# EAGLE schematic alu (EAGLE 9.6.2)
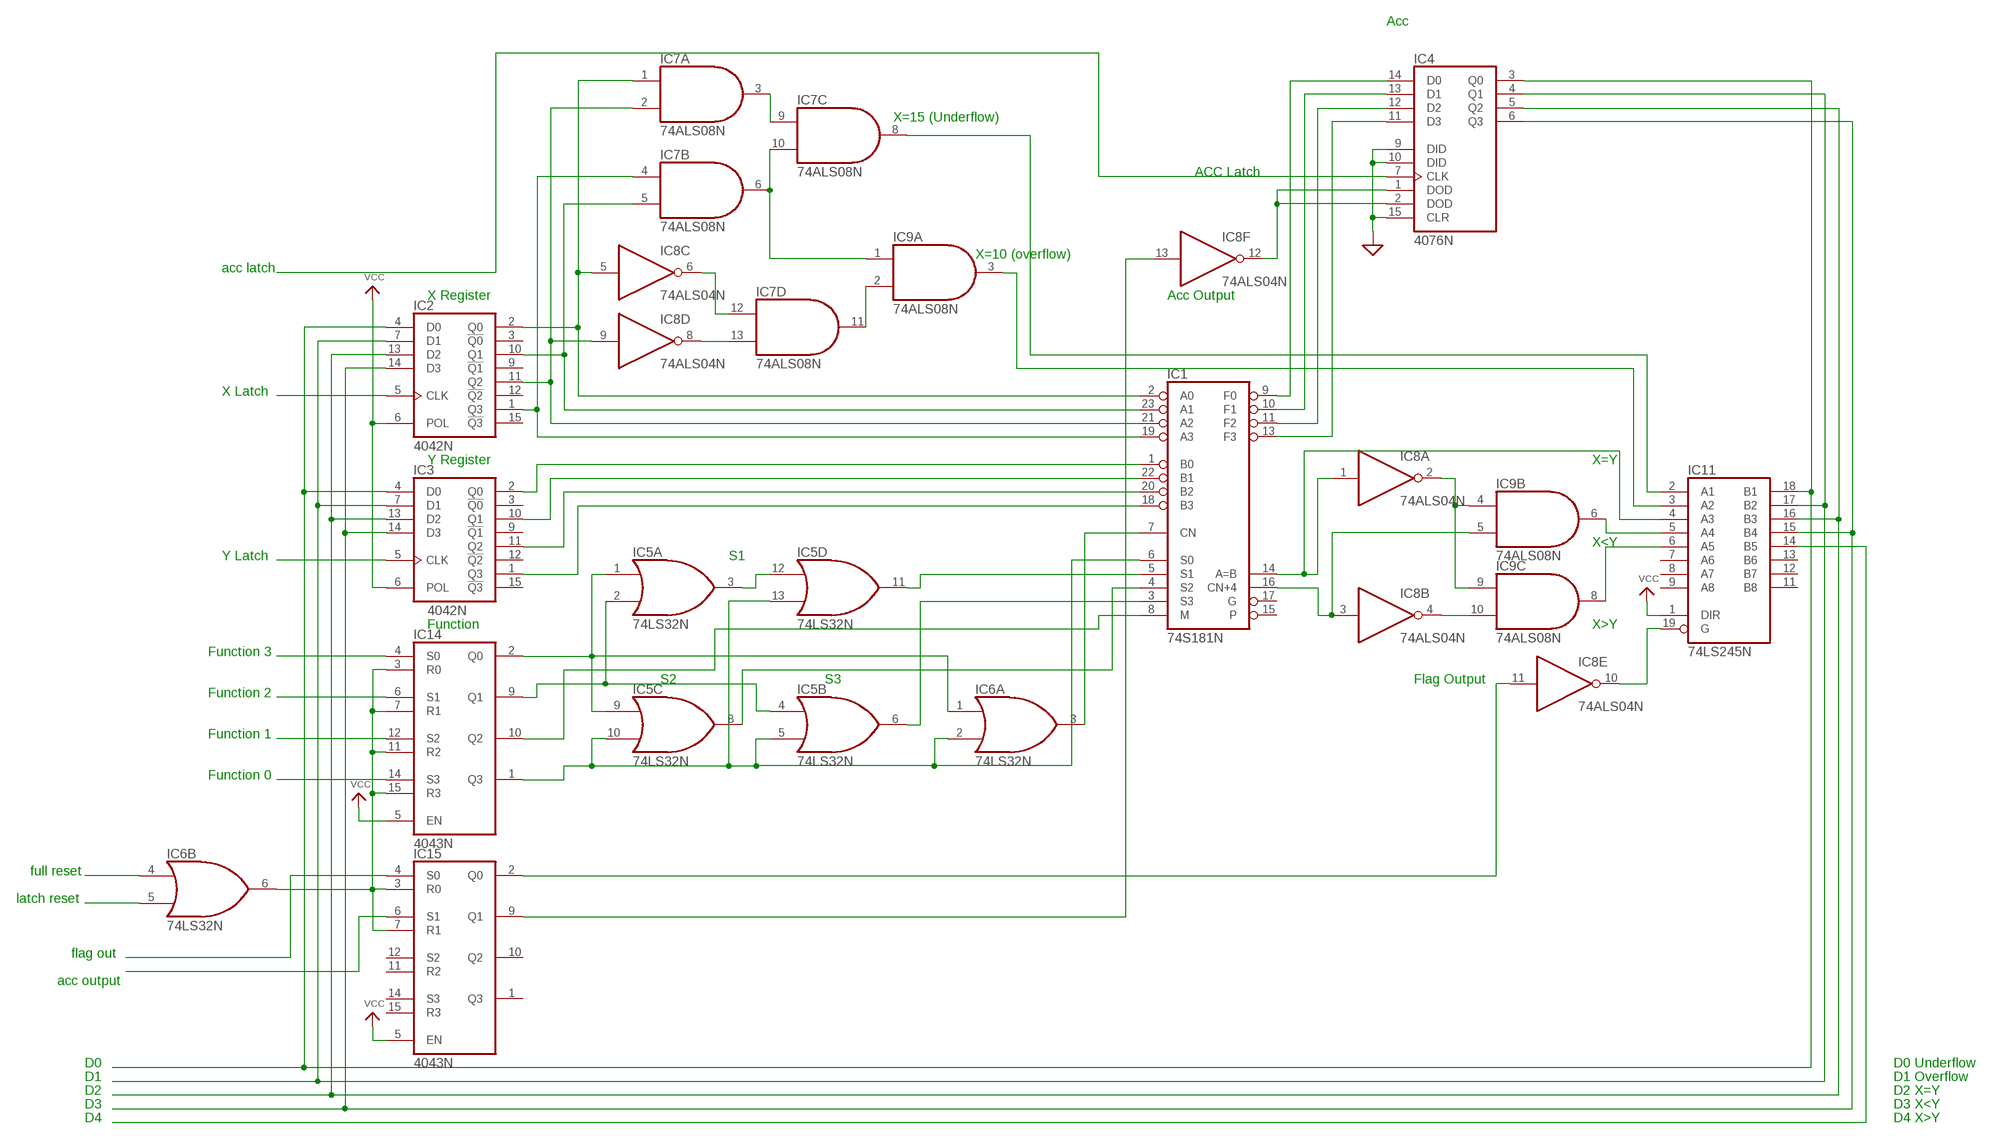
[diagram p0: schematic, sheet 1]

## Parts
IC1  74S181N  [DIL24-6]
IC2  4042N  [DIL16]
IC3  4042N  [DIL16]
IC4  4076N  [DIL16]
IC5  74LS32N  [DIL14]
IC6  74LS32N  [DIL14]
IC7  74ALS08N  [DIL14]
IC8  74ALS04N  [DIL14]
IC9  74ALS08N  [DIL14]
IC11  74LS245N  [DIL20]
IC14  4043N  [DIL16]
IC15  4043N  [DIL16]

## Nets
GND: IC4.9(DID) IC4.10(DID) IC4.15(CLR) ; supply symbol labelled SUP
N$1: IC1.2(A0) IC2.2(Q0) IC7.1(A:I0) IC8.5(C:I)
N$2: IC1.23(A1) IC2.10(Q1) IC7.5(B:I1)
N$3: IC7.13(D:I1) IC8.8(D:O)
N$4: IC1.19(A3) IC2.1(Q3) IC7.4(B:I0)
N$5: IC1.1(B0) IC3.2(Q0)
N$6: IC1.22(B1) IC3.10(Q1)
N$7: IC1.20(B2) IC3.11(Q2)
N$8: IC1.18(B3) IC3.1(Q3)
N$9: IC2.4(D0) IC3.4(D0) IC4.3(Q0) IC11.18(B1)
N$10: IC2.7(D1) IC3.7(D1) IC4.4(Q1) IC11.17(B2)
N$11: IC2.13(D2) IC3.13(D2) IC4.5(Q2) IC11.16(B3)
N$12: IC2.14(D3) IC3.14(D3) IC4.6(Q3) IC11.15(B4)
N$13: IC11.14(B5)
N$14: IC6.6(B:O) IC14.3(R0) IC14.7(R1) IC14.11(R2) IC14.15(R3) IC15.3(R0) IC15.7(R1)
N$15: IC4.1(DOD) IC4.2(DOD) IC8.12(F:O)
N$16: IC6.4(B:I0)
N$17: IC15.4(S0)
N$18: IC15.6(S1)
N$19: IC14.4(S0)
N$20: IC14.6(S1)
N$21: IC14.12(S2)
N$22: IC14.14(S3)
N$23: IC6.5(B:I1)
N$25: IC5.3(A:O) IC5.12(D:I0)
N$26: IC1.5(S1) IC5.11(D:O)
N$27: IC1.3(S3) IC5.6(B:O)
N$28: IC1.6(S0) IC5.5(B:I1) IC5.10(C:I1) IC5.13(D:I1) IC6.2(A:I1) IC14.1(Q3)
N$29: IC5.1(A:I0) IC5.9(C:I0) IC6.1(A:I0) IC14.2(Q0)
N$30: IC1.16(CN+4) IC8.3(B:I) IC9.5(B:I1)
N$31: IC1.4(S2) IC5.8(C:O)
N$32: IC1.8(M) IC14.10(Q2)
N$33: IC1.7(CN) IC6.3(A:O)
N$34: IC1.9(F0) IC4.14(D0)
N$35: IC5.2(A:I1) IC5.4(B:I0) IC14.9(Q1)
N$36: IC1.10(F1) IC4.13(D1)
N$37: IC1.11(F2) IC4.12(D2)
N$38: IC1.13(F3) IC4.11(D3)
N$39: IC4.7(CLK)
N$40: IC8.4(B:O) IC9.10(C:I1)
N$41: IC1.14(A=B) IC8.1(A:I) IC11.4(A3)
N$42: IC7.12(D:I0) IC8.6(C:O)
N$43: IC8.2(A:O) IC9.4(B:I0) IC9.9(C:I0)
N$44: IC7.3(A:O) IC7.9(C:I0)
N$45: IC7.6(B:O) IC7.10(C:I1) IC9.1(A:I0)
N$46: IC7.11(D:O) IC9.2(A:I1)
N$47: IC1.21(A2) IC2.11(Q2) IC7.2(A:I1) IC8.9(D:I)
N$49: IC9.3(A:O) IC11.3(A2)
N$50: IC7.8(C:O) IC11.2(A1)
N$55: IC9.6(B:O) IC11.5(A4)
N$56: IC9.8(C:O) IC11.6(A5)
N$61: IC8.10(E:O) IC11.19(G)
N$63: IC8.11(E:I) IC15.2(Q0)
N$64: IC8.13(F:I) IC15.9(Q1)
VCC: IC2.6(POL) IC3.6(POL) IC11.1(DIR) IC14.5(EN) IC15.5(EN)
XCLOCK: IC2.5(CLK)
YCLOCK: IC3.5(CLK)
Unconnected: IC1.15(P) IC1.17(G) IC2.3(!Q0) IC2.9(!Q1) IC2.12(!Q2) IC2.15(!Q3) IC3.3(!Q0) IC3.9(!Q1) IC3.12(!Q2) IC3.15(!Q3) IC6.8(C:O) IC6.9(C:I0) IC6.10(C:I1) IC6.11(D:O) IC6.12(D:I0) IC6.13(D:I1) IC9.11(D:O) IC9.12(D:I0) IC9.13(D:I1) IC11.7(A6) IC11.8(A7) IC11.9(A8) IC11.11(B8) IC11.12(B7) IC11.13(B6) IC15.1(Q3) IC15.10(Q2) IC15.11(R2) IC15.12(S2) IC15.14(S3) IC15.15(R3)

## Notes on the sheet
- Acc
- X=15 (Underflow)
- ACC Latch
- X=10 (overflow)
- acc latch
- X Register | Acc Output
- X Latch
- Y Register | X=Y
- X<Y
- Y Latch | S1
- Function | X>Y
- Function 3
- S2 | S3 | Flag Output
- Function 2
- Function 1
- Function 0
- full reset
- latch reset
- flag out
- acc output
- D0 | D0 Underflow
- D1 | D1 Overflow
- D2 | D2 X=Y
- D3 | D3 X<Y
- D4 | D4 X>Y

## Power pins joined to a net without a drawn wire
GND: IC1.12(GND) IC5.7(P:GND) IC6.7(P:GND) IC7.7(P:GND) IC8.7(P:GND) IC9.7(P:GND) IC11.10(GND)
VCC: IC1.24(VCC) IC5.14(P:VCC) IC6.14(P:VCC) IC7.14(P:VCC) IC8.14(P:VCC) IC9.14(P:VCC) IC11.20(VCC)
VDD: IC2.16(VDD) IC3.16(VDD) IC4.16(VDD) IC14.16(VDD) IC15.16(VDD)
VSS: IC2.8(VSS) IC3.8(VSS) IC4.8(VSS) IC14.8(VSS) IC15.8(VSS)

## Library data of the parts
IC1 = 74xx-us:74*181: ARITHMETIC LOGIC UNIT function generator
IC2 IC3 = 40xx:4042: Quad clocked D LATCH
IC4 = 40xx:4076: Quad D-type REGISTER
IC5 IC6 = 74xx-us:74*32: Quad 2-input OR gate
IC7 IC9 = 74xx-us:74*08: Quad 2-input AND gate
IC8 = 74xx-us:74*04: Hex INVERTER
IC11 = 74xx-us:74*245: Octal BUS TRANSCEIVER, 3-state
IC14 IC15 = 40xx:4043: Quad 3-state NOR R/S LATCH